# Altium project Group37.PrjPcb
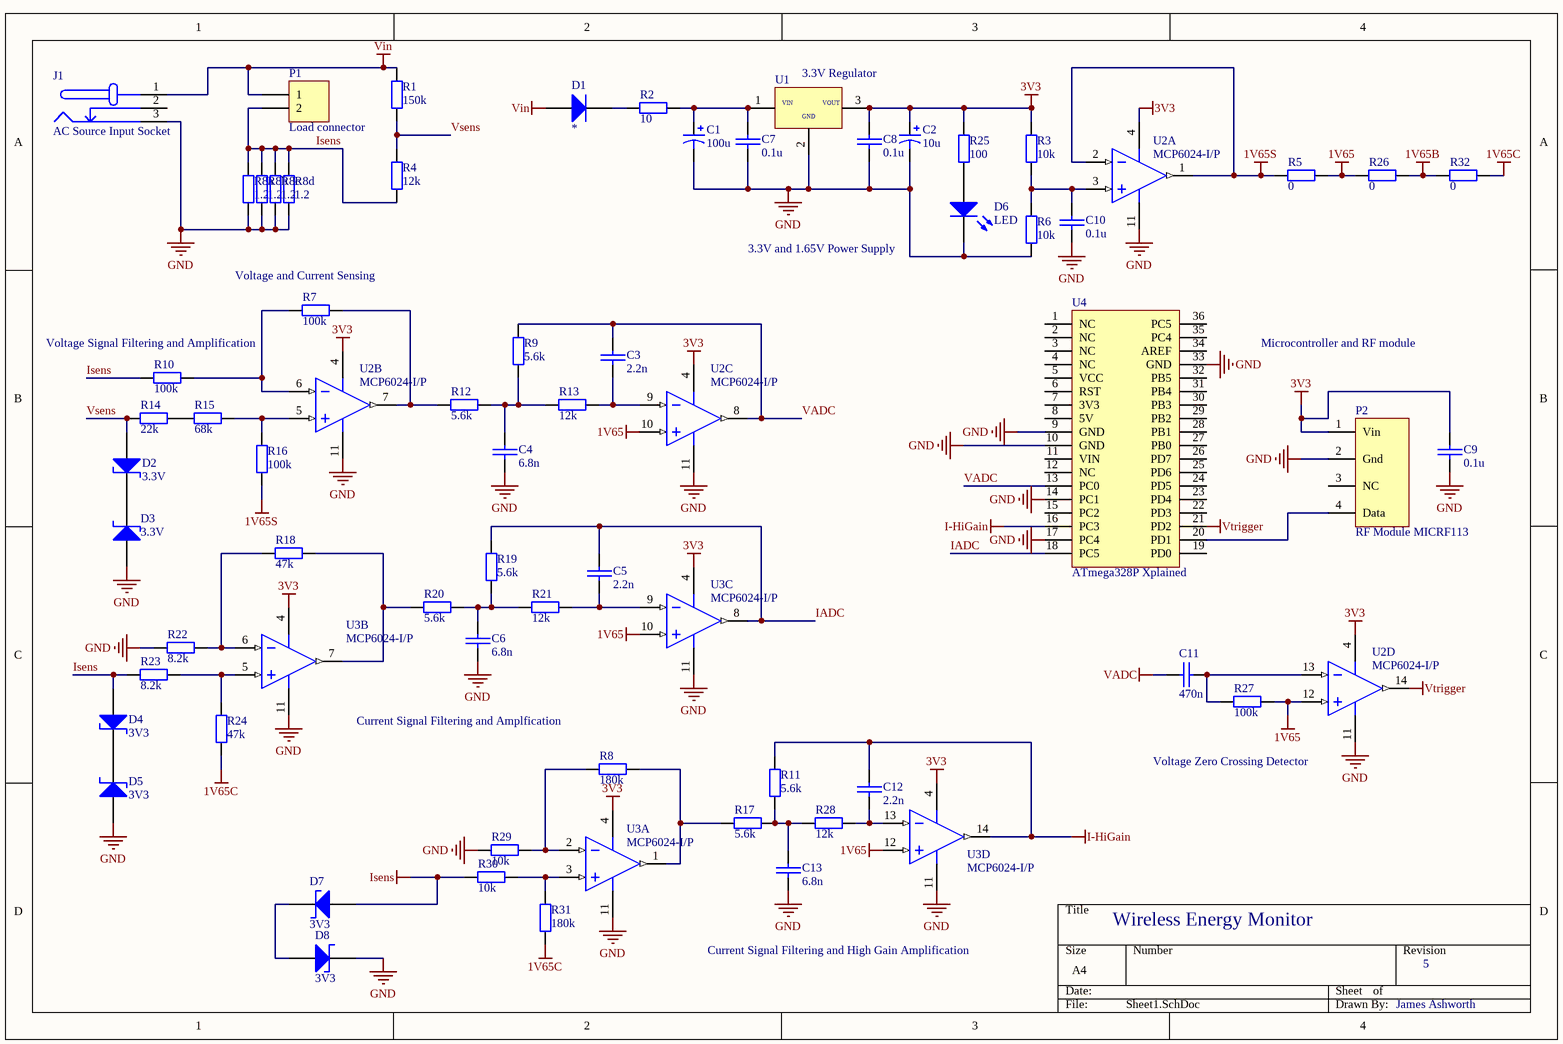
[diagram p0: Sheet1.SchDoc]
1 sheet, 64 parts. Net scope: global (net labels, ports and power ports of the same name join across sheets).
Board file: PCB1.PcbDoc

## Sheet Sheet1.SchDoc
size A4

### Parts
C1  100u  [CAP-RAD-3mm Pitch]
C2  10u  [CAP-RAD-2mm Pitch]
C3  2.2n  [FILM CAP-0.2]
C4  6.8n  [FILM CAP-0.2]
C5  2.2n  [FILM CAP-0.2]
C6  6.8n  [FILM CAP-0.2]
C7  0.1u  [ECE-CAPR0.2x0.1TH]
C8  0.1u  [ECE-CAPR0.2x0.1TH]
C9  0.1u  [FILM CAP-0.2]
C10  0.1u  [FILM CAP-0.2]
C11  470n  [FILM CAP-0.2]
C12  2.2n  [FILM CAP-0.2]
C13  6.8n  [FILM CAP-0.2]
D1  *  [AXIAL-DIODE-0.4]
D2  3.3V  [AXIAL-DIODE-0.4]
D3  3.3V  [AXIAL-DIODE-0.4]
D4  3V3  [AXIAL-DIODE-0.4]
D5  3V3  [AXIAL-DIODE-0.4]
D6  LED  [LED]
D7  3V3  [AXIAL-DIODE-0.4]
D8  3V3  [AXIAL-DIODE-0.4]
J1  AC Source Input Socket  [AC-Socket]
P1  Load connector  [Dual Banana Plug]
P2  RF Module MICRF113  [MICRF113 TX]
R1  150k  [AXIAL-0.4]
R2  10  [AXIAL-0.4]
R3  10k  [AXIAL-0.4]
R4  12k  [AXIAL-0.4]
R5  0  [AXIAL-0.4]
R6  10k  [AXIAL-0.4]
R7  100k  [AXIAL-0.4]
R8  180k  [AXIAL-0.4]
R8a  1.2  [AXIAL-0.4]
R8b  1.2  [AXIAL-0.4]
R8c  1.2  [AXIAL-0.4]
R8d  1.2  [AXIAL-0.4]
R9  5.6k  [AXIAL-0.4]
R10  100k  [AXIAL-0.4]
R11  5.6k  [AXIAL-0.4]
R12  5.6k  [AXIAL-0.4]
R13  12k  [AXIAL-0.4]
R14  22k  [AXIAL-0.4]
R15  68k  [AXIAL-0.4]
R16  100k  [AXIAL-0.4]
R17  5.6k  [AXIAL-0.4]
R18  47k  [AXIAL-0.4]
R19  5.6k  [AXIAL-0.4]
R20  5.6k  [AXIAL-0.4]
R21  12k  [AXIAL-0.4]
R22  8.2k  [AXIAL-0.4]
R23  8.2k  [AXIAL-0.4]
R24  47k  [AXIAL-0.4]
R25  100  [AXIAL-0.4]
R26  0  [AXIAL-0.4]
R27  100k  [AXIAL-0.4]
R28  12k  [AXIAL-0.4]
R29  10k  [AXIAL-0.4]
R30  10k  [AXIAL-0.4]
R31  180k  [AXIAL-0.4]
R32  0  [AXIAL-0.4]
U1  3.3V Regulator  [TO-92]
U2  MCP6024-I/P  [DIP-14]  (parts A,B,C,D of 4)
U3  MCP6024-I/P  [DIP-14]  (parts A,B,C,D of 4)
U4  ATmega328P Xplained  [ATmeg328P Xplained]

### Nets
1V65: R5.2 R26.1 R27.2 U2.10(VINC+) U2.12(VIND+) U3.10(VINC+) U3.12(VIND+)
1V65B: R26.2 R32.1
1V65C: R24.1 R31.1 R32.2
1V65S: R5.1 R16.1 U2.1(VOUTA) U2.2(VINA-)
3V3: C2.1 C8.1 C9.1 P2.1(Vin) R3.2 R25.2 U1.3(OUTPUT) U2.4(VDD) U3.4(VDD)
GND: C1.2 C2.2 C4.2 C6.2 C7.2 C8.2 C9.2 C10.2 C13.2 D3.1(A) D5.1(A) D6.2(K) D8.2(K) J1.3(GND) P2.2(Gnd) R6.1 R8a.1 R8b.1 R8c.1 R8d.1 R22.1 R29.2 U1.2(GND) U2.11(VSS) U3.11(VSS) U4.9(GND) U4.10(GND) U4.14(PC1) U4.17(PC4) U4.33(GND)
I-HiGain: C12.1 R11.1 U3.14(VOUTD) U4.16(PC3)
Isens: D4.1(A) D7.1(A) P1.2 R4.1 R8a.2 R8b.2 R8c.2 R8d.2 R10.1 R23.1 R30.1
VADC: C3.1 C11.2 R9.2 U2.8(VOUTC) U4.13(PC0)
Vin: D1.1(A) J1.1(VCC) P1.1 R1.2
Vtrigger: U2.14(VOUTD) U4.21(PD2)
IADC: C5.1 R19.1 U3.8(VOUTC) U4.18(PC5)
Vsens: D2.1(A) R1.1 R4.2 R14.1
NetC1_1: C1.1 C7.1 R2.2 U1.1(INPUT)
NetC3_2: C3.2 R13.1 U2.9(VINC-)
NetC4_1: C4.1 R9.1 R12.2 R13.2
NetC5_2: C5.2 R21.1 U3.9(VINC-)
NetC6_1: C6.1 R19.2 R20.1 R21.2
NetC10_1: C10.1 R3.1 R6.2 U2.3(VINA+)
NetC11_1: C11.1 R27.1 U2.13(VIND-)
NetC12_2: C12.2 R28.1 U3.13(VIND-)
NetC13_1: C13.1 R11.2 R17.1 R28.2
NetD1_2: D1.2(K) R2.1
NetD2_2: D2.2(K) D3.2(K)
NetD4_2: D4.2(K) D5.2(K)
NetD6_1: D6.1(A) R25.1
NetD7_2: D7.2(K) D8.1(A)
NetP2_4: P2.4(Data) U4.20(PD1)
NetR7_1: R7.1 R10.2 U2.6(VINB-)
NetR7_2: R7.2 R12.1 U2.7(VOUTB)
NetR8_1: R8.1 R17.2 U3.1(VOUTA)
NetR8_2: R8.2 R29.1 U3.2(VINA-)
NetR14_2: R14.2 R15.1
NetR15_2: R15.2 R16.2 U2.5(VINB+)
NetR18_1: R18.1 R20.2 U3.7(VOUTB)
NetR18_2: R18.2 R22.2 U3.6(VINB-)
NetR23_2: R23.2 R24.2 U3.5(VINB+)
NetR30_2: R30.2 R31.2 U3.3(VINA+)

Not connected (* = marked no-connect by the designer): J1 2(GND_ALT); P2 3(NC); U4 1(NC) 2(NC) 3(NC) 4(NC) 5(VCC) 6(RST) 7(3V3) 8(5V) 11(VIN) 12(NC) 15(PC2) 19(PD0) 22(PD3) 23(PD4) 24(PD5) 25(PD6) 26(PD7) 27(PB0) 28(PB1) 29(PB2) 30(PB3) 31(PB4) 32(PB5) 34(AREF) 35(PC4) 36(PC5)

### Notes on the sheet
- 3.3V and 1.65V Power Supply
- (near R7) Voltage and Current Sensing
- Voltage Signal Filtering and Amplification
- Microcontroller and RF module
- Current Signal Filtering and Amplfication
- Voltage Zero Crossing Detector
- Wireless Energy Monitor
- Current Signal Filtering and High Gain Amplification
- 5
- James Ashworth
- (in symbol LP2950-33) VIN; VOUT

### Library data of the parts
C1 = Cap Pol (22uF-100uF): Polarized Capacitor (Axial); Published: 8-Jun-2000; LatestRevisionDate: 17-Jul-2002; LatestRevisionNote: Re-released for DXP Platform.; PackageReference: POLAR0.8; Publisher: Altium Limited; PackageDescription: Polarized Capacitor; 2 Leads; Value: *
C2 = Cap Pol (1uF-10uF): Polarized Capacitor (Axial); Published: 8-Jun-2000; LatestRevisionDate: 17-Jul-2002; LatestRevisionNote: Re-released for DXP Platform.; PackageReference: POLAR0.8; Publisher: Altium Limited; PackageDescription: Polarized Capacitor; 2 Leads; Value: *
C3-C6 C9-C13 = CAP: Capacitor Non Polarised Through Hole; Value: *
C7 C8 = CAP000001: CAP CER 10pF 50V TH; Manufactuer: TDK; Manufacturer-PN: FK28C0G1H100D; Assembly Method: Through hole; Item Type: Item; Path: ece/ts/Lists/Stock Inventory; UoA Stock#: CAP000001; Value: 10pF; Size/Package: Radial; Voltage/Current: 50V; Datasheet Link: http://share.engineering.auckland.ac.nz/ece/ts/Student%20Documents/CER%20CAP.pdf; Supplier1: Electus; Supplier1-PN: RC5312; Component Type: NA; Category: Capacitor; Review-date: 41972; Status: Active
D1 = Diode: Manufacturer: Fairchild Semiconductor; Revision 1: 11-July-2000: SIM Model Added.; Revision 2: July-2002: Re-released for DXP Platform.; Class I: Discrete; Class II: Diode - Switching; Published: 8-Jun-2000; Datasheet: Latest Revision: 1997; Package Reference: DO-35; Publisher: Altium Limited; Value: *
D2-D5 D7 D8 = Zener: Zener Diode; Value: *
D6 = LED: Typical GaAs LED; Manufacturer: Generic Components; Class I: Optoelectronic; Published: 8-Jun-2000; Revision: July-2002: Re-released for DXP Platform.; Publisher: Altium Limited; Class II: LED; Value: *
J1 = AC Input: Value: socket
P1 = Dual Banana Plugs: M6 Holes; LatestRevisionDate: 17-Jul-2002; LatestRevisionNote: Re-released for DXP Platform.; Publisher: Altium Limited
P2 = RF Module: Vertical Mount RF Module
R1-R8 R8a R8b R8c R8d R9-R32 = Res: Through Hole Resistor; Published: 8-Jun-2000; LatestRevisionDate: 17-Jul-2002; LatestRevisionNote: Re-released for DXP Platform.; PackageReference: AXIAL-0.4; Publisher: Altium Limited; Value: *
U1 = LP2950-33
U2 U3 = MCP6024-I/P: Rail-to-Rail Input/Output, 10 MHz Operational Amplifier, 14-Pin PDIP, Industrial Temperature; FirstPublished: 29-Jan-2009; LatestRevisionDate: 02-Dec-2009; LatestRevisionNote: Updated to datasheet revision D, Feb-2009; DatasheetVersion: revD, Feb-2009; PackageVersion: revBB, Aug-2009; PackageReference: PDIP300-P14; Publisher: Altium Limited; PackageDescription: 14-Lead Plastic Dual In-Line (P) - 300 mil Body [PDIP]; ComponentLink1Description: Datasheet; ComponentLink1URL: http://ww1.microchip.com/downloads/en/DeviceDoc/21685d.pdf; ComponentLink2Description: Packaging Specification; ComponentLink2URL: http://www.microchip.com/stellent/groups/techpub_sg/documents/packagingspec/en012702.pdf; ComponentLink3Description: Microchip.com Home; ComponentLink3URL: http://www.microchip.com/
U4 = ATmega328P Xplained: Header, 18-Pin, Dual row; LatestRevisionDate: 17-Jul-2002; LatestRevisionNote: Re-released for DXP Platform.; Publisher: Altium Limited